# EAGLE design lat_stm_zybo_rev (EAGLE 9.6.2)
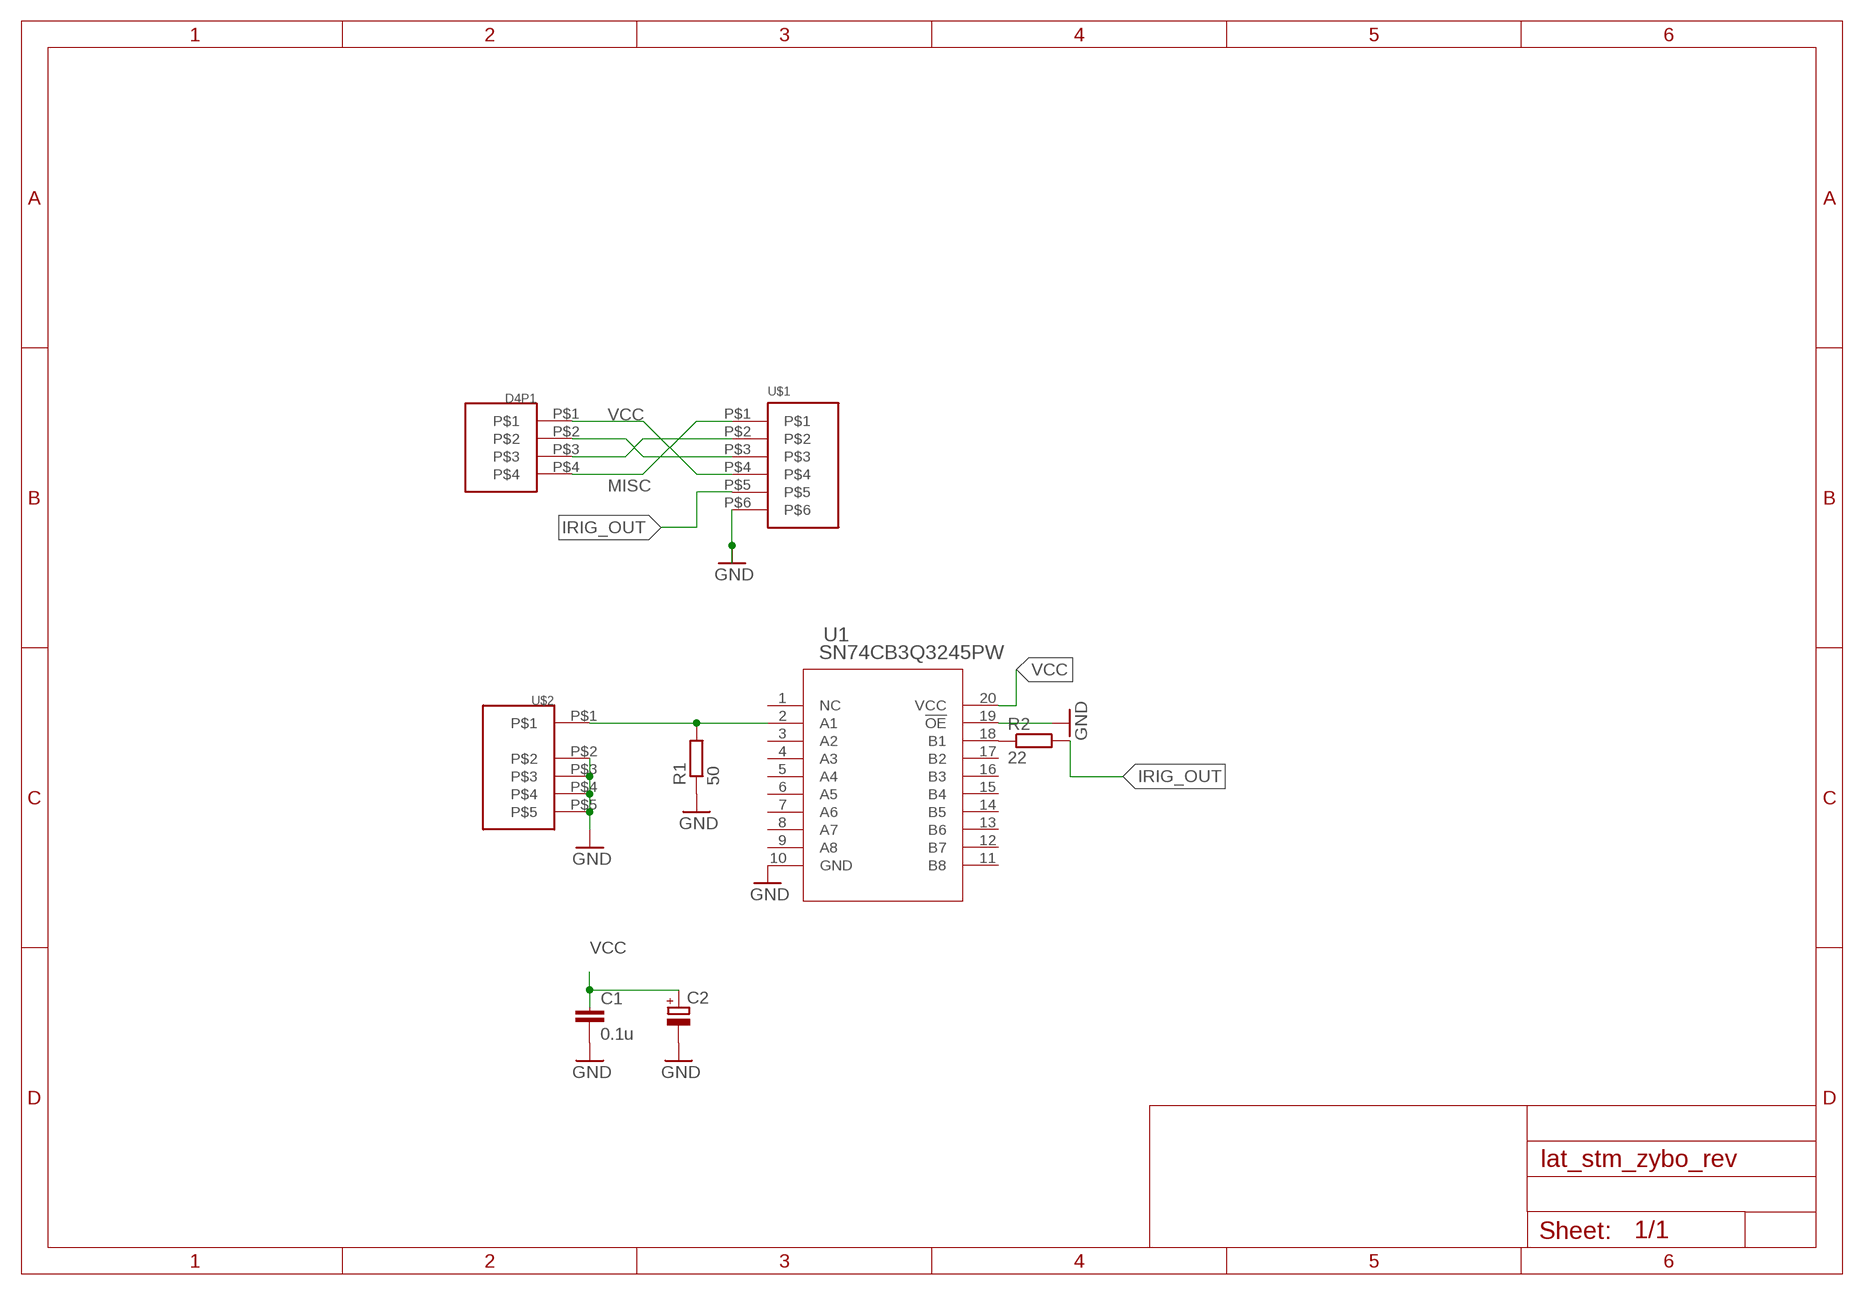
[diagram p0: schematic, sheet 1]

## Parts
C1  0.1u  C-EUC0603  [C0603]
C2  CPOL-EUE2,5-6E  [E2,5-6E]
D4P1  DF1E-4P  [DF1E-4P]
R1  50  R-EU_R0603  [R0603]
R2  22  R-EU_R0603  [R0603]
U1  SN74CB3Q3245PW  [PW20]
U$1  DF1E-6P  [DF1E-6P]
U$2  546-4049  [546-4049]

## Nets
GND: C1.2 C2.- R1.1 U1.10(GND) U1.19(!OE) U$1.P$6 U$2.P$2 U$2.P$3 U$2.P$4 U$2.P$5
IRIG_IN: R1.2 U1.2(A1) U$2.P$1
IRIG_OUT: R2.2 U$1.P$5
MISC: D4P1.P$4 U$1.P$1
N$1: R2.1 U1.18(B1)
N$2: D4P1.P$2 U$1.P$3
N$3: D4P1.P$3 U$1.P$2
VCC: C1.1 C2.+ D4P1.P$1 U1.20(VCC) U$1.P$4
Unconnected: U1.1(NC) U1.3(A2) U1.4(A3) U1.5(A4) U1.6(A5) U1.7(A6) U1.8(A7) U1.9(A8) U1.11(B8) U1.12(B7) U1.13(B6) U1.14(B5) U1.15(B4) U1.16(B3) U1.17(B2)

## Library data of the parts
C1 = rcl:C-EU: CAPACITOR, European symbol; SPICEPREFIX: C
C2 = rcl:CPOL-EU: POLARIZED CAPACITOR, European symbol; SPICEPREFIX: C
D4P1 = lib_test:DF1E-4P
R1 R2 = rcl:R-EU_: RESISTOR, European symbol; SPICEPREFIX: R
U1 = lib_test:SN74CB3Q3245PW; DATASHEET_URL: http://www.ti.com/lit/gpn/SN74CB3Q3245; DESCRIPTION: 8-Bit 2.5-V/3.3-V Low-Voltage FET Bus Switch; FAMILY_NAME: DIGITAL BUS SWITCH; GENERIC_PART_NUMBER: SN74CB3Q3245; INDUSTRY_STD_PKG_TYPE: TSSOP; MANUFACTURER: Texas Instruments; MANUFACTURER_PART_NUMBER: SN74CB3Q3245PW; PACKAGE_DESIGNATOR: PW; PIN_COUNT: 20; VENDOR: Texas Instruments
U$1 = lib_test:DF1E-6P
U$2 = lib_test:546-4049

## Board
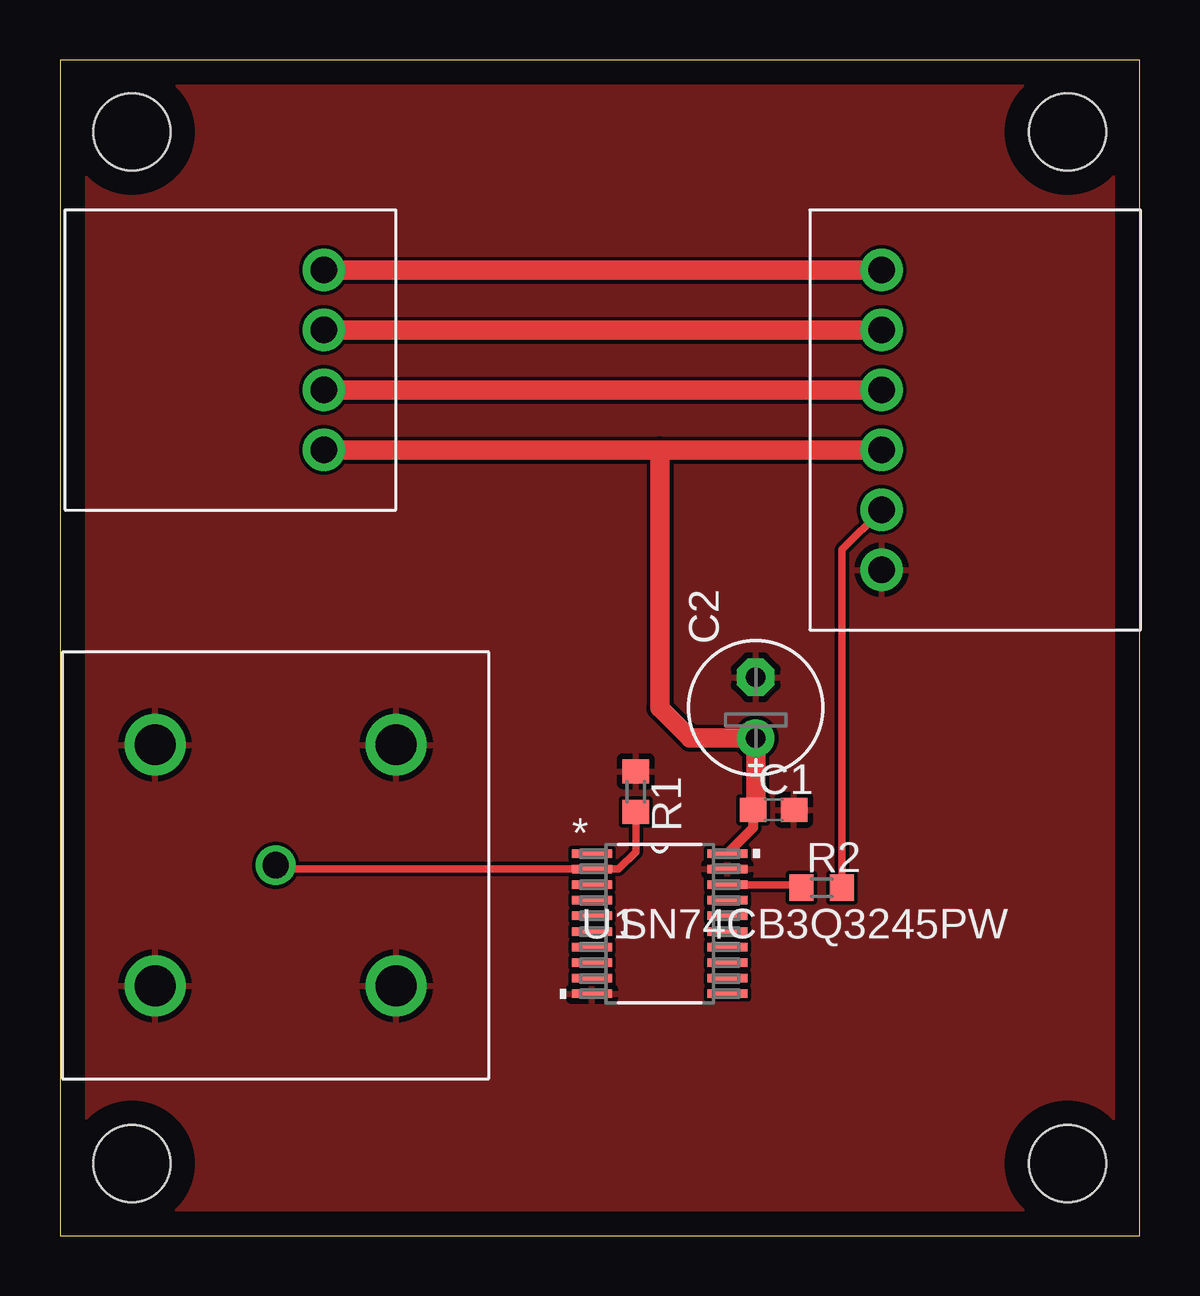
[diagram p1: board, top side]

Size 45 x 49 mm. Coordinates in mm from the lower left corner, seen from the top.
Outline: 0,0 45,0 45,49 0,49 0,0
Copper layers (1*16): Top 0.035mm / dielectric 1.5mm / Bottom 0.035mm
Design rules "default": minimum track width 6mil, minimum drill 0.35mm, track to track 6mil, track to pad 6mil, pad to pad 6mil, via to via 6mil, smd to smd 6mil, copper to edge 40mil, drill to drill 6mil, minimum pad ring 10mil, minimum via ring 8mil, stop-mask expansion 4mil, vias tented up to drill 0mil, thermal gap 10mil
Holes 3.2 mm at 3,46 42,46 42,3 3,3

### Footprints (pad centres in the part's own frame; a part is rotated, then mirrored left to right if it is on the bottom)
C0603 = smd 1.1 x 1: 1 -0.85,0; 2 0.85,0
E2,5-6E = drill 0.813 pad 1.575: + -1.27,0 | drill 0.813 pad 1.575 octagon: - 1.27,0
DF1E-4P = drill 1.1 pad 1.778: P$1 0,3.75; P$2 0,1.25; P$3 0,-1.25; P$4 0,-3.75
R0603 = smd 1 x 1.1: 1 -0.85,0; 2 0.85,0
PW20 = smd 1.676 x 0.356: 1 -2.819,2.925; 2 -2.819,2.275; 3 -2.819,1.625; 4 -2.819,0.975; 5 -2.819,0.325; 6 -2.819,-0.325; 7 -2.819,-0.975; 8 -2.819,-1.625; 9 -2.819,-2.275; 10 -2.819,-2.925; 11 2.819,-2.925; 12 2.819,-2.275; 13 2.819,-1.625; 14 2.819,-0.975; 15 2.819,-0.325; 16 2.819,0.325; 17 2.819,0.975; 18 2.819,1.625; 19 2.819,2.275; 20 2.819,2.925
DF1E-6P = drill 1.1 pad 1.778: P$1 0,6.25; P$2 0,3.75; P$3 0,1.25; P$4 0,-1.25; P$5 0,-3.75; P$6 0,-6.25
546-4049 = drill 1.1: P$1 0,0 | drill 1.7: P$2 -5.025,5.025; P$3 5.025,5.025; P$4 5.025,-5.025; P$5 -5.025,-5.025

### Placement (x,y rotation side)
C1  29.75,17.75 0 top
C2  29,22 90 top
D4P1  11,36.5 180 top
R1  24,18.5 270 top
R2  31.75,14.5 0 top
U1  25,13 0 top
U$1  34.25,34 0 top
U$2  8.99,15.43 0 top

### Tracks (layer width: path | path; a pad name or v marks a point on that pad's centre or on a via)
GND
  pour Top: 0,49 0,0 45,0 45,49
IRIG_IN
  Top 0.305: U$2.P$1 9.14,15.28 U1.2 23.27,15.28 24,16 R1.2
IRIG_OUT
  Top 0.305: U$1.P$5 32.6,28.6 R2.2
MISC
  Top 0.813: D4P1.P$4 U$1.P$1
N$1
  Top 0.305: U1.18 30.77,14.62 R2.1
N$2
  Top 0.813: D4P1.P$2 U$1.P$3
N$3
  Top 0.813: D4P1.P$3 U$1.P$2
VCC
  Top 0.406: U1.20 28.9,17.01 C1.1
  Top 0.813: C1.1 29,17.85 C2.+ 26.27,20.73 25,22 25,32.75 | D4P1.P$1 25,32.75 | 25,32.75 U$1.P$4